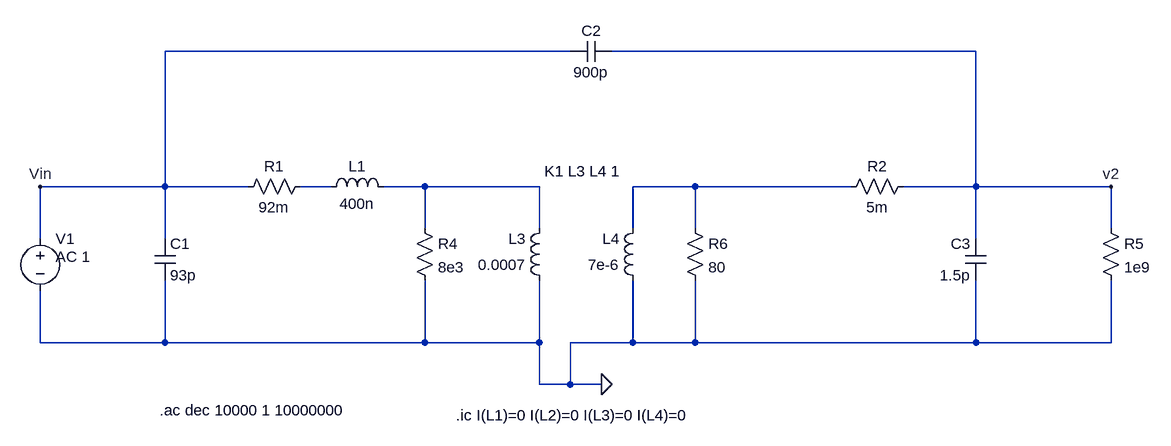
[diagram p0: schematic PlanarTransformer_Sweep.asc]
PlanarTransformer_Sweep.asc, the LTspice schematic file:
Version 4.1
SHEET 1 2512 1248
WIRE 464 -192 -160 -192
WIRE 1088 -192 528 -192
WIRE -160 16 -160 -192
WIRE -160 16 -352 16
WIRE -32 16 -160 16
WIRE 96 16 48 16
WIRE 240 16 176 16
WIRE 416 16 240 16
WIRE 656 16 560 16
WIRE 896 16 656 16
WIRE 1088 16 1088 -192
WIRE 1088 16 976 16
WIRE 1296 16 1088 16
WIRE 240 80 240 16
WIRE 416 80 416 16
WIRE 560 80 560 16
WIRE 656 80 656 16
WIRE 1296 80 1296 16
WIRE -352 96 -352 16
WIRE -160 96 -160 16
WIRE 1088 96 1088 16
WIRE -352 256 -352 176
WIRE -160 256 -160 160
WIRE -160 256 -352 256
WIRE 240 256 240 160
WIRE 240 256 -160 256
WIRE 416 256 416 160
WIRE 416 256 240 256
WIRE 560 256 560 160
WIRE 560 256 464 256
WIRE 656 256 656 160
WIRE 656 256 560 256
WIRE 1088 256 1088 160
WIRE 1088 256 656 256
WIRE 1296 256 1296 160
WIRE 1296 256 1088 256
WIRE 416 320 416 256
WIRE 464 320 464 256
WIRE 464 320 416 320
WIRE 512 320 464 320
FLAG 512 320 0
FLAG 1296 16 v2
FLAG -352 16 Vin
SYMBOL voltage -352 80 R0
WINDOW 123 0 0 Left 0
WINDOW 39 0 0 Left 0
WINDOW 3 24 44 Left 2
SYMATTR Value AC 1
SYMATTR InstName V1
SYMBOL res 64 0 R90
WINDOW 0 0 56 VBottom 2
WINDOW 3 32 56 VTop 2
SYMATTR InstName R1
SYMATTR Value 92m
SYMBOL res 992 0 R90
WINDOW 0 0 56 VBottom 2
WINDOW 3 32 56 VTop 2
SYMATTR InstName R2
SYMATTR Value 5m
SYMBOL ind 432 176 R180
WINDOW 0 36 80 Left 2
WINDOW 3 36 40 Left 2
SYMATTR InstName L3
SYMATTR Value 0.0007
SYMATTR Type ind
SYMBOL ind 576 176 R180
WINDOW 0 36 80 Left 2
WINDOW 3 36 40 Left 2
SYMATTR InstName L4
SYMATTR Value 7e-6
SYMATTR Type ind
SYMBOL ind 80 32 R270
WINDOW 0 32 56 VTop 2
WINDOW 3 5 56 VBottom 2
SYMATTR InstName L1
SYMATTR Value 400n
SYMBOL res 1280 64 R0
SYMATTR InstName R5
SYMATTR Value 1e9
SYMBOL cap -176 96 R0
SYMATTR InstName C1
SYMATTR Value 93p
SYMBOL cap 528 -208 R90
WINDOW 0 0 32 VBottom 2
WINDOW 3 32 32 VTop 2
SYMATTR InstName C2
SYMATTR Value 900p
SYMBOL cap 1104 160 R180
WINDOW 0 24 56 Left 2
WINDOW 3 24 8 Left 2
SYMATTR InstName C3
SYMATTR Value 1.5p
SYMBOL res 224 64 R0
SYMATTR InstName R4
SYMATTR Value 8e3
SYMBOL res 640 64 R0
SYMATTR InstName R6
SYMATTR Value 80
TEXT 424 -8 Left 2 !K1 L3 L4 1
TEXT 288 368 Left 2 !.ic I(L1)=0 I(L2)=0 I(L3)=0 I(L4)=0
TEXT -168 360 Left 2 !.ac dec 10000 1 10000000

The netlist it stands for:
* PlanarTransformer_Sweep.asc
V1 Vin 0 AC 1
R1 N001 Vin 92m
R2 v2 N003 5m
L3 0 N002 0.0007
L4 0 N003 7e-6
L1 N001 N002 400n
R5 v2 0 1e9
C1 Vin 0 93p
C2 v2 Vin 900p
C3 0 v2 1.5p
R4 N002 0 8e3
R6 N003 0 80
K1 L3 L4 1
.ic I(L1)=0 I(L2)=0 I(L3)=0 I(L4)=0
.ac dec 10000 1 10000000
.backanno
.end